# EAGLE schematic ESP8266_usb_spi_connector3 (EAGLE 7.6.0)
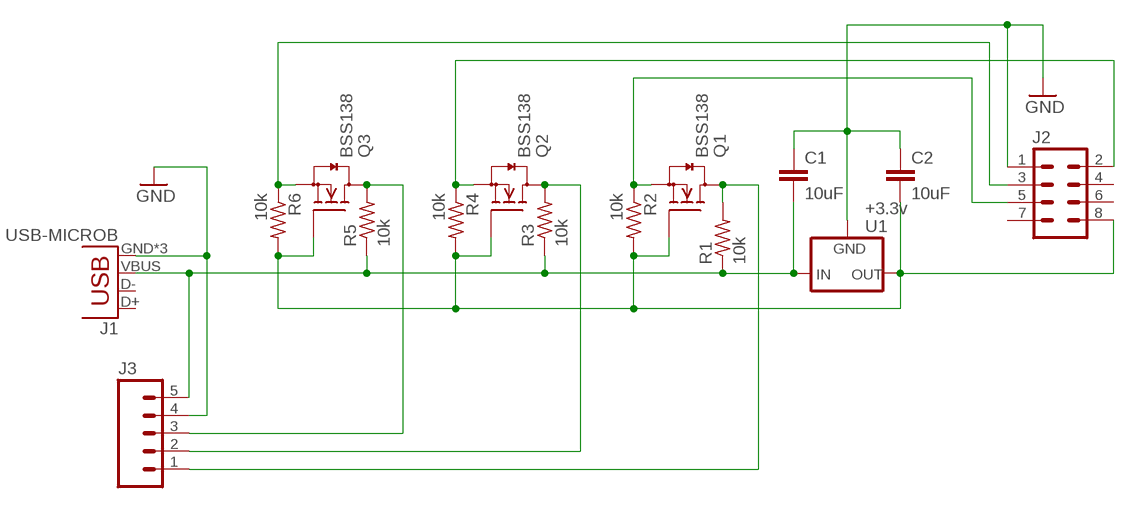
[diagram p0: schematic, sheet 1]

## Parts
C1  10uF  CAP1206  [1206]
C2  10uF  CAP1206  [1206]
J1  USB-MICROB  [USB-MICROB]
J2  M04X2  [2X4]
J3  M05PTH  [1X05]
Q1  BSS138  [SOT23]
Q2  BSS138  [SOT23]
Q3  BSS138  [SOT23]
R1  10k  R-US_M1206  [M1206]
R2  10k  R-US_M1206  [M1206]
R3  10k  R-US_M1206  [M1206]
R4  10k  R-US_M1206  [M1206]
R5  10k  R-US_M1206  [M1206]
R6  10k  R-US_M1206  [M1206]
U1  +3.3v  V_REG_78XX7812  [TO-252]

## Nets
GND: C1.1 C2.1 J1.GND J1.MT1(GND) J1.MT2(GND) J2.1 J3.4 U1.3(GND)
N$1: J3.3 Q3.3(D) R5.2
N$2: J2.3 Q3.2(S) R6.1
N$4: J3.2 Q2.3(D) R3.2
N$7: J2.2 Q2.2(S) R4.1
N$9: J2.5 Q1.2(S) R2.1
N$10: C1.2 J1.VBUS J3.5 R1.1 R3.1 R5.1 U1.1(IN)
N$11: J3.1 Q1.3(D) R1.2
N$12: C2.2 J2.8 Q1.1(G) Q2.1(G) Q3.1(G) R2.2 R4.2 R6.2 U1.2(OUT)
Unconnected: J1.D+ J1.D- J2.4 J2.6 J2.7

## Library data of the parts
C1 C2 = SparkFun-Passives:CAP: Capacitor Standard 0603 ceramic capacitor, and 0.1" leaded capacitor.
J1 = SparkFun-Connectors:USB: USB Connectors USB-B-PTH is fully proven SKU : PRT-00139/CONN-08278 USB-miniB is fully proven SKU : PRT-00587 USB-A-PCB is untested. USB-A-H is throughly reviewed, but untested. Spark Fun Electronics SKU : PRT-00437 USB-B-SMT is throughly reviewed, but untested. Needs silkscreen touching up. USB-A-S has not been used/tested USB-MB-H has not been used/tested USB-MICROB has been used. CONN-09505; PROD_ID: CONN-09505
J2 = SparkFun-Connectors:M04X2: .1" header, two rows of four.
J3 = SparkFun-Connectors:M05: Header 5 Standard 5-pin 0.1" header. Use with straight break away headers (SKU : PRT-00116), right angle break away headers (PRT-00553), swiss pins (PRT-00743), machine pins (PRT-00117), and female headers (PRT-00115). Molex polarized connector foot print use with SKU : PRT-08230 with associated crimp pins and housings.
Q1-Q3 = m-pad-2.1:BSS138: Fairchild Semiconductors BSS138 N-Channel Logic Level Enhancement Mode Field Effect Transistor General Description: These N-Channel enhancement mode field effect transistors are produced using Fairchild's proprietary, high cell density, DMOS technology. These products have been designed to minimize on-state resistance while provide rugged, reliable, and fast switching performance.These products are particularly suited for low voltage, low current applications such as small servo motor control, power MOSFET gate drivers, and other switching applications. Features: 0.22 A, 50 V. RDS(ON) = 3.5Ohm @ VGS = 10 V RDS(ON) = 6.0Ohm @ VGS = 4.5 V High density cell design for extremely low RDS(ON) Rugged and Reliable Compact industry standard SOT-23 surface mount package Please send any comments to: messi@users.sourceforge.net
R1-R6 = resistor:R-US_: RESISTOR, American symbol
U1 = SparkFun-PowerIC:V_REG_78XX: Voltage Regulator Standard 78xx regulator. IGO (Input Ground Output). Spark Fun Electronics SKU : COM-00107; PROD_ID: VREG-12370; VALUE: +12v